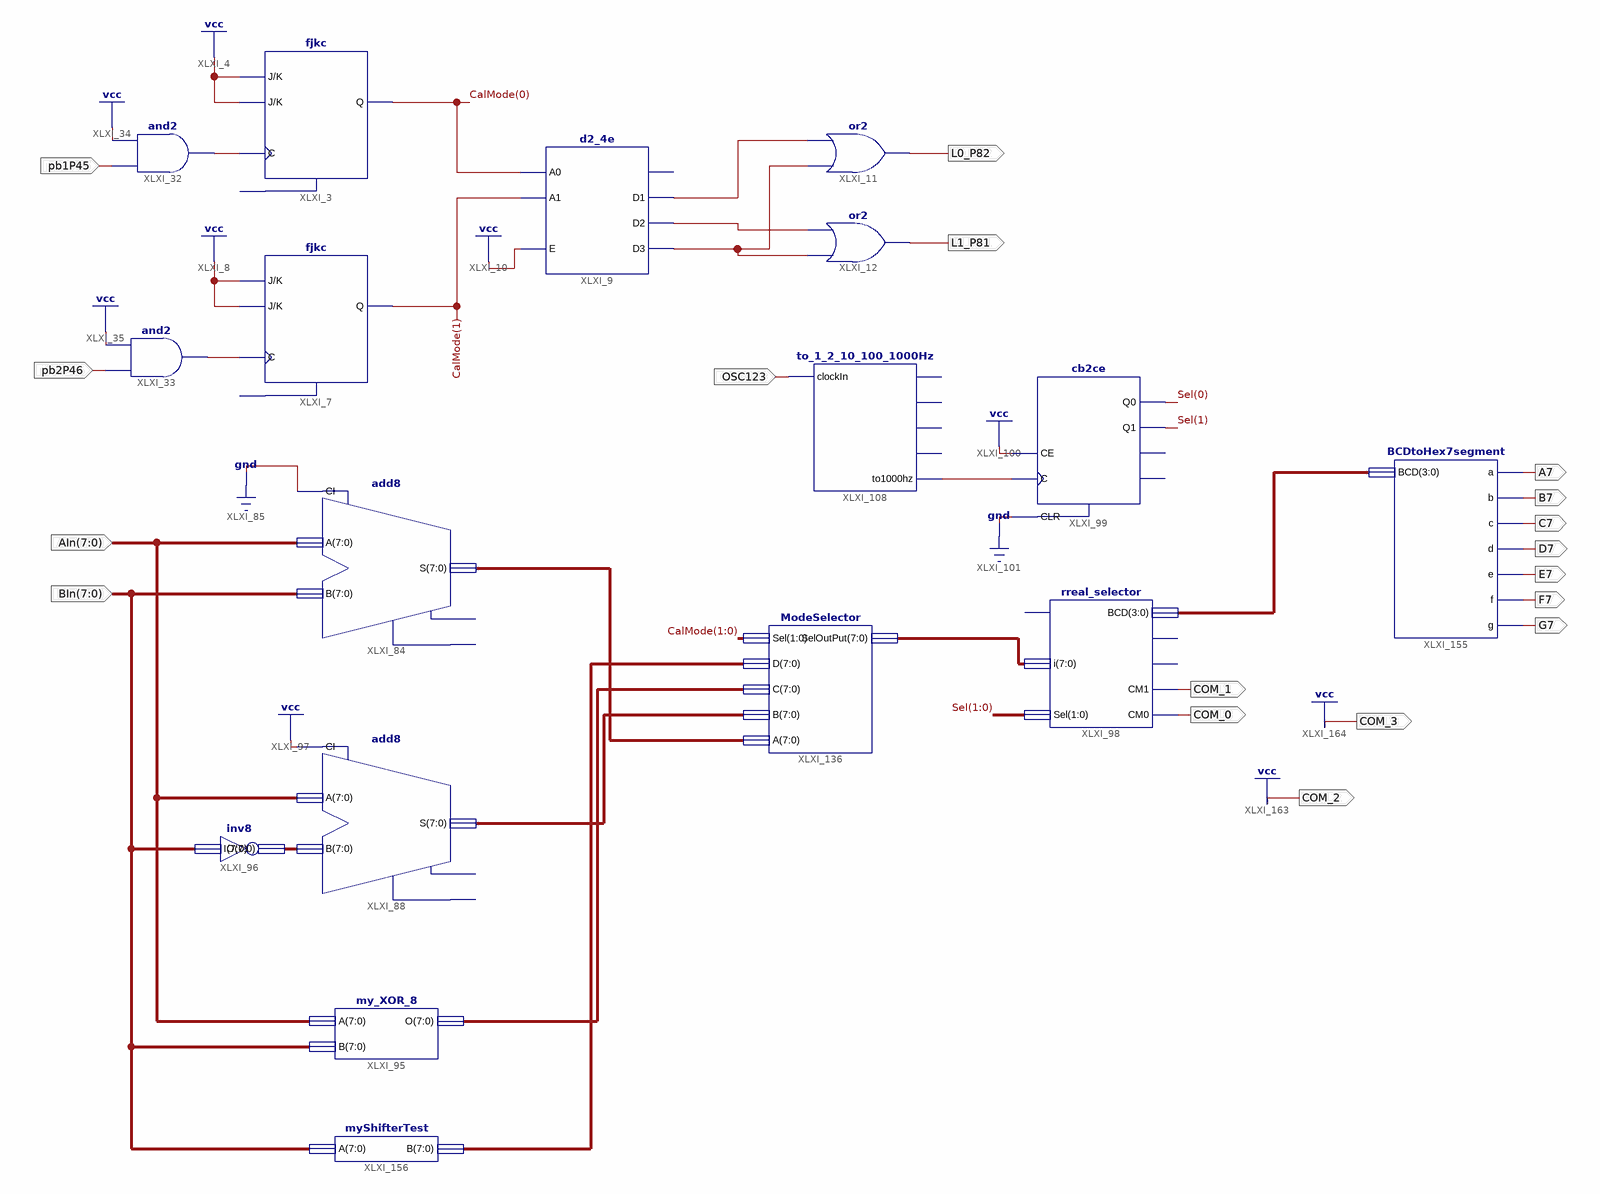
[diagram p0: schematic sheet 1]
// Xilinx ISE schematic finalCircuit.sch (spartan6) as structural Verilog: 17 symbols, 18 ports
module finalCircuit (
  input  pb1P45,
  input  pb2P46,
  input  [7:0] AIn,
  input  [7:0] BIn,
  input  OSC123,
  output L1_P81,
  output L0_P82,
  output COM_1,
  output COM_0,
  output A7,
  output B7,
  output C7,
  output D7,
  output E7,
  output F7,
  output G7,
  output COM_3,
  output COM_2
);

  wire XLXN_187, XLXN_281, XLXN_282, XLXN_283, XLXN_291, XLXN_292;
  wire [1:0] CalMode, Sel;
  wire [3:0] XLXN_293;
  wire [7:0] XLXN_173, XLXN_239, XLXN_264, XLXN_265, XLXN_266, XLXN_295;

  d2_4e XLXI_9 (.A0(CalMode[0]), .A1(CalMode[1]), .E(1'b1), .D1(XLXN_281), .D2(XLXN_282), .D3(XLXN_283));  // open: D0
  fjkc XLXI_7 (.C(XLXN_292), .J(1'b1), .K(1'b1), .Q(CalMode[1]));  // open: CLR
  fjkc XLXI_3 (.C(XLXN_291), .J(1'b1), .K(1'b1), .Q(CalMode[0]));  // open: CLR
  and XLXI_32 (XLXN_291, pb1P45, 1'b1);
  and XLXI_33 (XLXN_292, pb2P46, 1'b1);
  add8 XLXI_84 (.A(AIn), .B(BIn), .CI(1'b0), .S(XLXN_264));  // open: CO, OFL
  add8 XLXI_88 (.A(AIn), .B(XLXN_173), .CI(1'b1), .S(XLXN_265));  // open: CO, OFL
  my_XOR_8 XLXI_95 (.A(AIn), .B(BIn), .O(XLXN_266));
  inv8 XLXI_96 (.I(BIn), .O(XLXN_173));
  rreal_selector XLXI_98 (.i(XLXN_239), .Sel(Sel), .BCD(XLXN_293), .CM1(COM_1), .CM0(COM_0));  // open: carry, CM3, CM2
  or XLXI_12 (L1_P81, XLXN_283, XLXN_282);
  or XLXI_11 (L0_P82, XLXN_283, XLXN_281);
  ModeSelector XLXI_136 (.Sel(CalMode), .D(XLXN_295), .C(XLXN_266), .B(XLXN_265), .A(XLXN_264), .SelOutPut(XLXN_239));
  cb2ce XLXI_99 (.C(XLXN_187), .CE(1'b1), .CLR(1'b0), .Q0(Sel[0]), .Q1(Sel[1]));  // open: CEO, TC
  to_1_2_10_100_1000Hz XLXI_108 (.clockIn(OSC123), .to1000hz(XLXN_187));  // open: to1hz, to2hz, to10hz, to100hz
  BCDtoHex7segment XLXI_155 (.BCD(XLXN_293), .a(A7), .b(B7), .c(C7), .e(E7), .f(F7), .g(G7), .d(D7));
  myShifterTest XLXI_156 (.A(BIn), .B(XLXN_295));

  assign COM_2 = 1'b1;
  assign COM_3 = 1'b1;
endmodule
